# Altium project Fast_Servo.PrjPCB (part 5 of 7)

## Sheet PWR_SMPS.SchDoc: Power SMPS
size 420 x 297 mm; Author: P. Zdunek; DrawnBy: P. Zdunek; Organization: Altium Limited; Address1: L3, 12a Rodborough Rd; Address2: Frenchs Forest; Address3: NSW; Address4: Australia 2086; DocumentNumber: 28; SheetNumber: 28; SheetTotal: 37; ModifiedBy: -; CheckedDate: -; Title2: Fast Stabilizer; DivGrp: WUT ISE; Designer: G.Kasprowicz
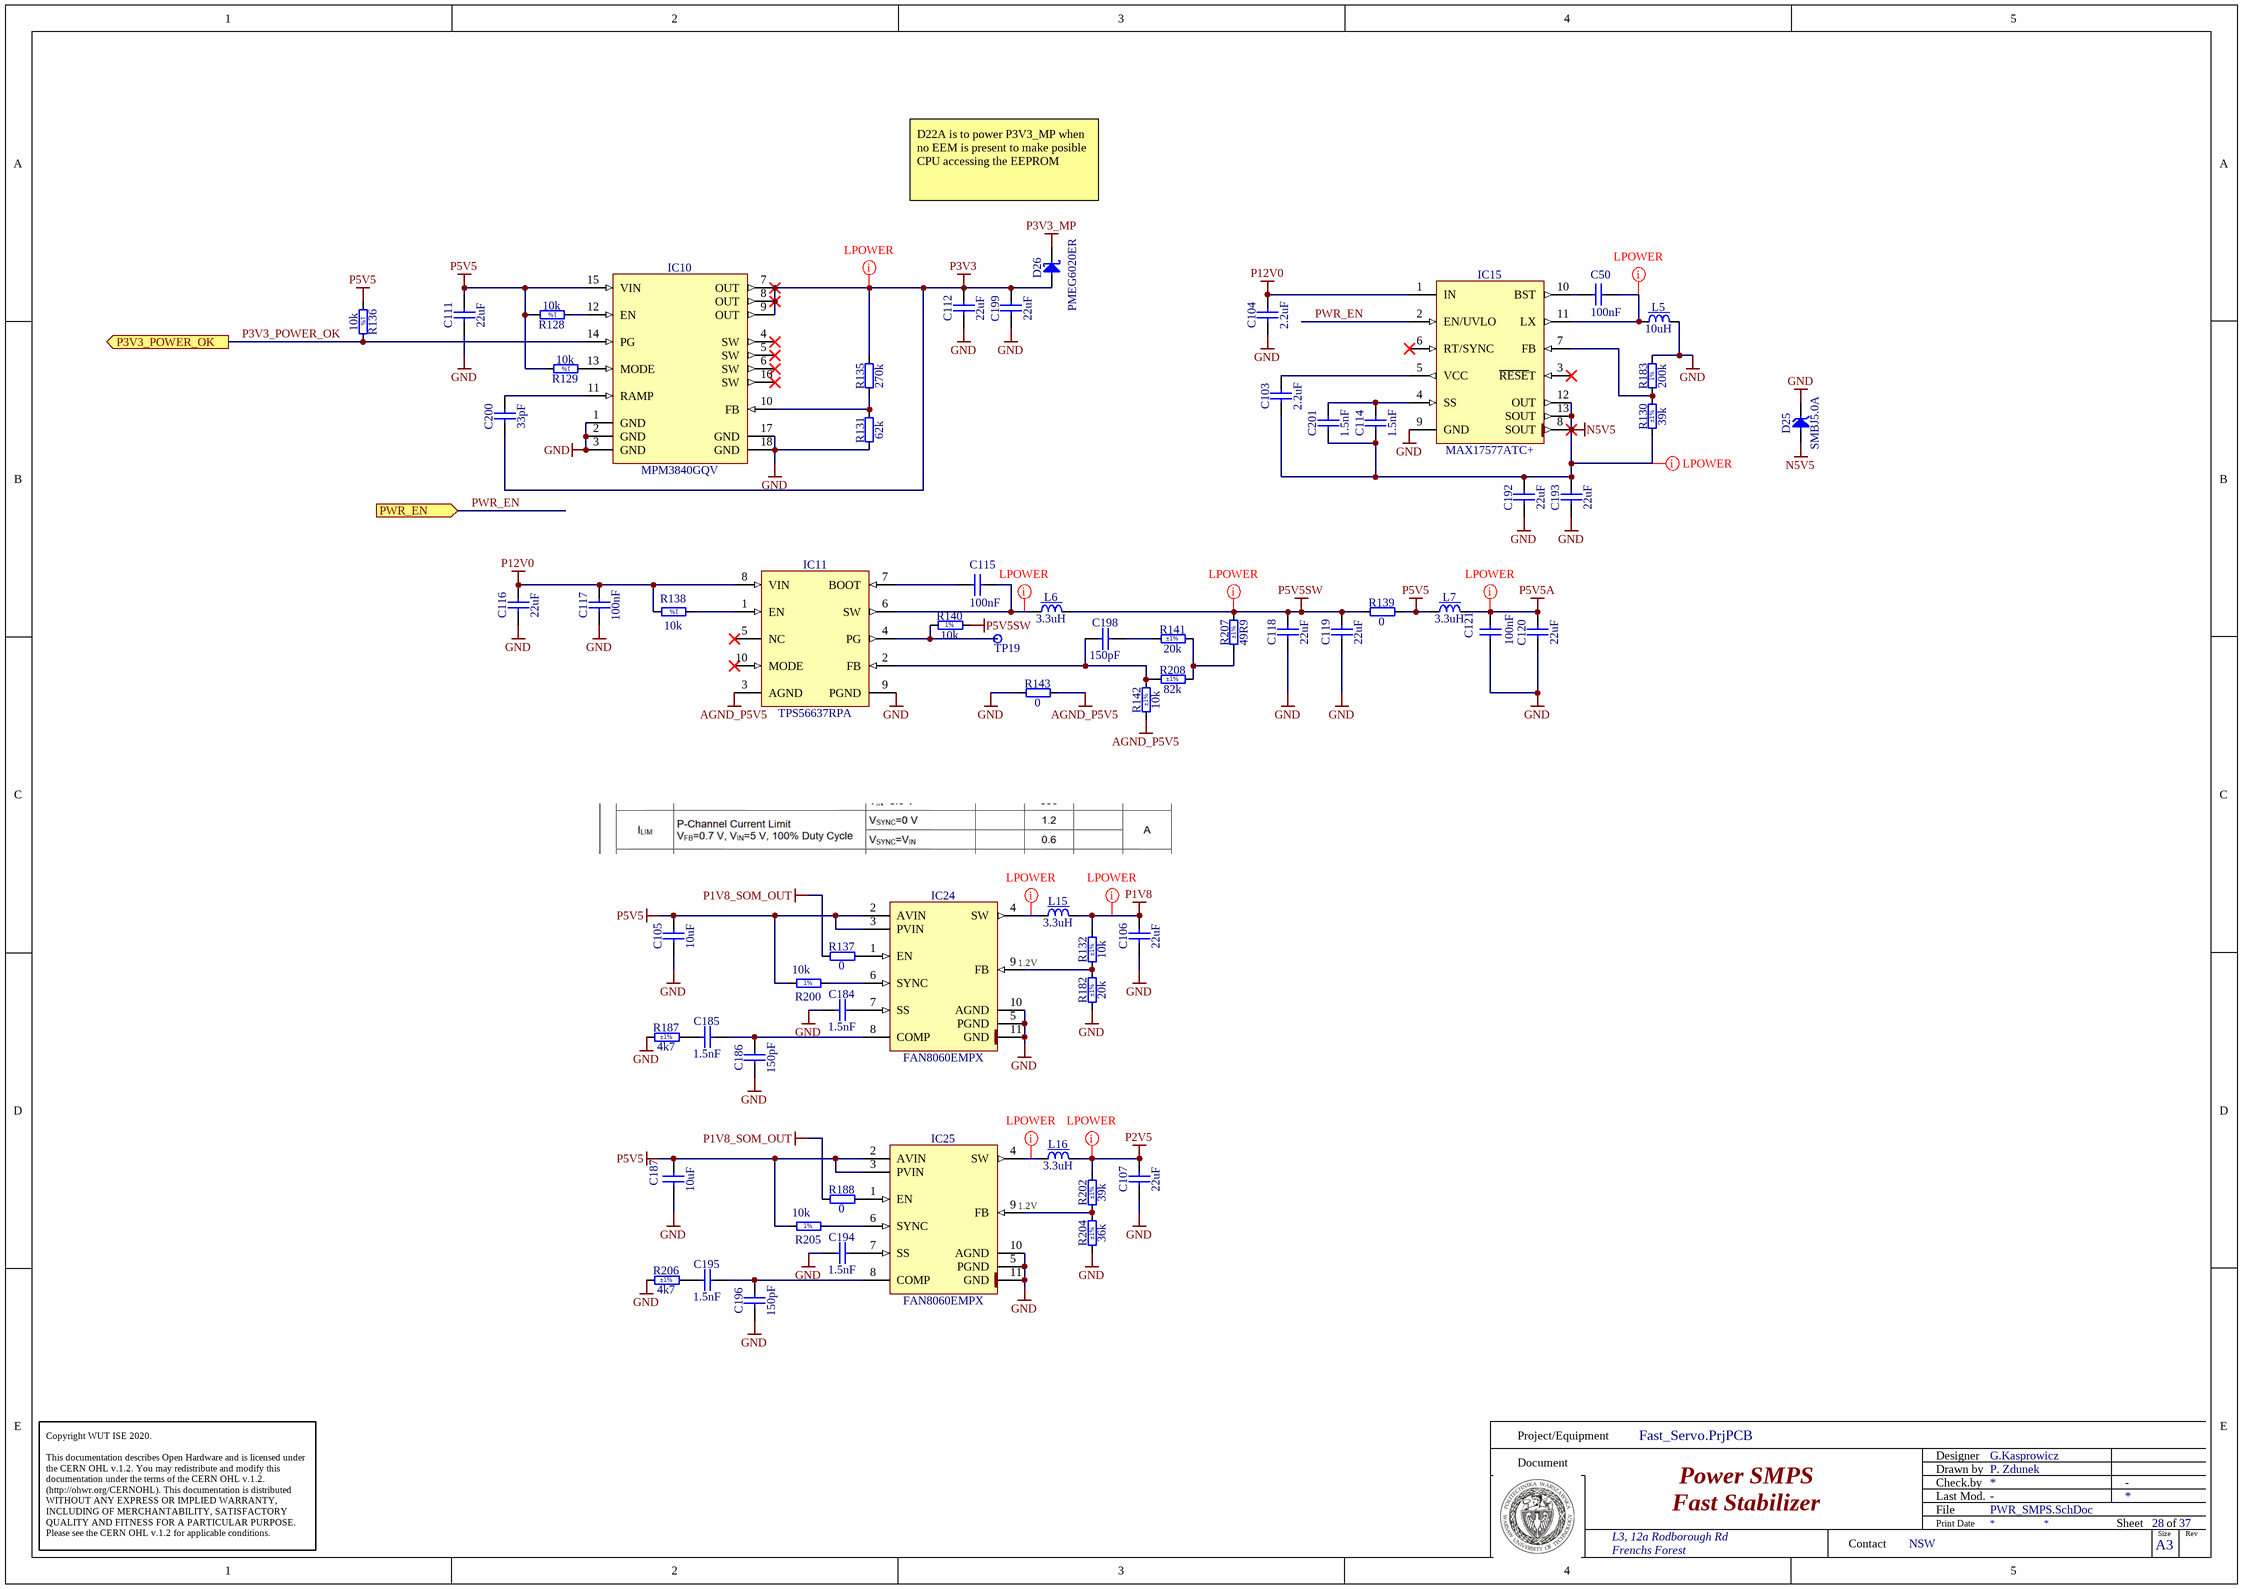
[diagram p20: PWR_SMPS.SchDoc]

### Parts
C50  100nF  [CAPC1005X55N]
C103  2.2uF  [CAPC2012X140N]
C104  2.2uF  [CAPC2012X140N]
C105  10uF  [CAPC1608X80N]
C106  22uF  [CAPC2012X135N]
C107  22uF  [CAPC2012X135N]
C111  22uF  [CAPC2012X135N]
C112  22uF  [CAPC2012X135N]
C114  1.5nF  [CAPC1005X55N]
C115  100nF  [CAPC1005X55N]
C116  22uF  [CAPC2012X135N]
C117  100nF  [CAPC1005X55N]
C118  22uF  [CAPC2012X135N]
C119  22uF  [CAPC2012X135N]
C120  22uF  [CAPC2012X135N]
C121  100nF  [CAPC1005X55N]
C184  1.5nF  [CAPC1005X55N]
C185  1.5nF  [CAPC1005X55N]
C186  150pF  [CAPC1005X55N]
C187  10uF  [CAPC1608X80N]
C192  22uF  [CAPC2012X135N]
C193  22uF  [CAPC2012X135N]
C194  1.5nF  [CAPC1005X55N]
C195  1.5nF  [CAPC1005X55N]
C196  150pF  [CAPC1005X55N]
C198  150pF  [CAPC1005X55N]
C199  22uF  [CAPC2012X135N]
C200  33pF  [CAPC1608X87N]
C201  1.5nF  [CAPC1005X55N]
D25  SMBJ5.0A  [DIOM5336X265N]
D26  PMEG6020ER  [SODFL3517X110N]
IC10  MPM3840GQV  [MPS_MPM38XXGQV]
IC11  TPS56637RPA  [TEXAS_RPA0010A]
IC15  MAX17577ATC+  [SON50P300X300X80-13N-R180X260]
IC24  FAN8060EMPX  [SON50P300X80_HS-11N]
IC25  FAN8060EMPX  [SON50P300X80_HS-11N]
L5  10uH  [IND_TDK_VLCF5020-1]
L6  3.3uH  [INDM6965X300N]
L7  3.3uH  [IND_WURTH_WE-TPC_4828]
L15  3.3uH  [IND_WURTH_WE-TPC_4828]
L16  3.3uH  [IND_WURTH_WE-TPC_4828]
R128  10k  [RESC1005X40N]
R129  10k  [RESC1005X40N]
R130  39k  Tolerance: ±1%  [RESC1005X40N]
R131  62k  [RESC1005X40N]
R132  10k  Tolerance: ±1%  [RESC1005X40N]
R135  270k  [RESC1005X40N]
R136  10k  [RESC1005X40N]
R137  0  [RESC1005X40N]
R138  10k  [RESC1005X40N]
R139  0  [RESC3116X80N]
R140  10k  [RESC1005X40N]
R141  20k  Tolerance: ±1%  [RESC1005X40N]
R142  10k  Tolerance: ±1%  [RESC1005X40N]
R143  0  [RESC1005X40N]
R182  20k  Tolerance: ±1%  [RESC1005X40N]
R183  200k  [RESC1005X40N]
R187  4k7  Tolerance: ±1%  [RESC1005X40N]
R188  0  [RESC1005X40N]
R200  10k  [RESC1005X40N]
R202  39k  Tolerance: ±1%  [RESC1005X40N]
R204  36k  Tolerance: ±1%  [RESC1005X40N]
R205  10k  [RESC1005X40N]
R206  4k7  Tolerance: ±1%  [RESC1005X40N]
R207  49R9  Tolerance: ±1%  [RESC1005X40N]
R208  82k  Tolerance: ±1%  [RESC1608X55N]
TP19  Test Point  [TPS127]  (value not drawn)  (no BOM)

### Ports
P3V3_POWER_OK (out), PWR_EN (in)

### Nets
AGND_P5V5: IC11.3(AGND) R142.1 R143.2
GND: C104.1 C105.1 C106.1 C107.1 C111.1 C112.1 C116.1 C117.1 C118.1 C119.1 C120.1 C121.1 C184.1 C186.1 C187.1 C192.1 C193.1 C194.1 C196.1 C199.1 D25.1(C) IC10.1(GND) IC10.2(GND) IC10.3(GND) IC10.17(GND) IC10.18(GND) IC11.9(PGND) IC15.9(GND) IC24.5(PGND) IC24.10(AGND) IC24.11(GND) IC25.5(PGND) IC25.10(AGND) IC25.11(GND) L5.2 R131.1 R143.1 R182.1 R183.2 R187.1 R204.1 R206.1
N5V5: C103.1 C114.1 C192.2 C193.2 C201.1 D25.2(A) IC15.8(SOUT) IC15.12(OUT) IC15.13(SOUT) R130.1
P1V8: C106.2 L15.2 R132.2
P1V8_SOM_OUT: R137.1 R188.1
P2V5: C107.2 L16.2 R202.2
P3V3: C112.2 C199.2 C200.1 D26.2(A) IC10.7(OUT) IC10.8(OUT) IC10.9(OUT) R135.2
P3V3_MP: D26.1(C)
P5V5: C105.2 C111.2 C187.2 IC10.15(VIN) IC24.2(AVIN) IC24.3(PVIN) IC25.2(AVIN) IC25.3(PVIN) L7.1 R128.2 R129.2 R136.1 R139.2 R200.1 R205.1
P5V5A: C120.2 C121.2 L7.2
P5V5SW: C118.2 C119.2 L6.2 R139.1 R140.2 R207.2
P12V0: C104.2 C116.2 C117.2 IC11.8(VIN) IC15.1(IN) R138.2
P3V3_POWER_OK: IC10.14(PG) R136.2 ; port P3V3_POWER_OK
PWR_EN: IC15.2(EN/UVLO) ; port PWR_EN
NetC50_1: C50.1 IC15.11(LX) L5.1
NetC50_2: C50.2 IC15.10(BST)
NetC103_2: C103.2 IC15.5(VCC)
NetC114_2: C114.2 C201.2 IC15.4(SS)
NetC115_1: C115.1 IC11.6(SW) L6.1
NetC115_2: C115.2 IC11.7(BOOT)
NetC184_2: C184.2 IC24.7(SS)
NetC185_1: C185.1 R187.2
NetC185_2: C185.2 C186.2 IC24.8(COMP)
NetC194_2: C194.2 IC25.7(SS)
NetC195_1: C195.1 R206.2
NetC195_2: C195.2 C196.2 IC25.8(COMP)
NetC198_1: C198.1 IC11.2(FB) R142.2 R208.1
NetC198_2: C198.2 R141.1
NetC200_2: C200.2 IC10.11(RAMP)
NetIC10_10: IC10.10(FB) R131.2 R135.1
NetIC10_12: IC10.12(EN) R128.1
NetIC10_13: IC10.13(MODE) R129.1
NetIC11_1: IC11.1(EN) R138.1
NetIC11_4: IC11.4(PG) R140.1 TP19.1
NetIC15_7: IC15.7(FB) R130.2 R183.1
NetIC24_1: IC24.1(EN) R137.2
NetIC24_4: IC24.4(SW) L15.1
NetIC24_6: IC24.6(SYNC) R200.2
NetIC24_9: IC24.9(FB) R132.1 R182.2
NetIC25_1: IC25.1(EN) R188.2
NetIC25_4: IC25.4(SW) L16.1
NetIC25_6: IC25.6(SYNC) R205.2
NetIC25_9: IC25.9(FB) R202.1 R204.2
NetR141_2: R141.2 R207.1 R208.2

Not connected (* = marked no-connect by the designer): IC10 4(SW)* 5(SW)* 6(SW)* 16(SW)*; IC11 5(NC)* 10(MODE)*; IC15 3(~{RESE}T)* 6(RT/SYNC)*

### Layout directives
net class Lpower: N5V5, NetC50_1, NetC115_1, NetIC24_4, NetIC25_4, P1V8, P2V5, P3V3, P5V5A, P5V5SW

### Notes on the sheet
- D22A is to power P3V3_MP when no EEM is present to make posible CPU accessing the EEPROM
- (near IC24) 1.2V
- (near IC25) 1.2V
- Project/Equipment
- Document
- Designer
- Drawn by
- Check.by
- Copyright WUT ISE 2020.
  This documentation describes Open Hardware and is licensed under the CERN OHL v.1.2. You may redistribute and modify this documentation under the terms of the CERN OHL v.1.2. (http://ohwr.org/CERNOHL). This documentation is distributed WITHOUT ANY EXPRESS OR IMPLIED WARRANTY, INCLUDING OF MERCHANTABILITY, SATISFACTORY QUALITY AND FITNESS FOR A PARTICULAR PURPOSE. Please see the CERN OHL v.1.2 for applicable conditions.
- Contact
- File
- Last Mod.
- Print Date
- Sheet
- Size
- A3
- of
- Rev
- (in symbol R0402_10K_1%_0.0625W_100PPM) 1%
- (in symbol R0402_200K_1%_0.0625W_100PPM) 1%

### Library data of the parts
C50 C115 C117 C121 = CC0402_100NF_16V_10%_X5R: Non-polarised capacitor; Part Description: SMD Multilayer Chip Ceramic Capacitor; Manufacturer: GENERIC; Manufacturer1 Part Number: GRM155R61C104KA88D; Voltage: 16V; TC: X5R; Tolerance: ±10%; Part Number: CC0402_100NF_16V_10%_X5R; Component Kind: Standard; Component Type: Standard; Pin Count: 2; Value: 100nF; Status: None; Manufacturer Part Number: CC0402_100NF_16V_10%_X5R; Case: 0402; Mounted: Yes; Socket: No; SMD: Yes; Sense: No; Manufacturer1 Example: MURATA; Manufacturer1 ComponentHeight: 0.55mm; HelpURL: \\cern.ch\dfs\Applications\Altium\Datasheets\CC0402_X5R_MURATA_GRM.pdf; Author: CERN DEM JLC; CreateDate: 10.12.2013; LatestRevisionDate: 10.12.2013
C103 C104 = CC0805_2.2UF_50V_10%_X7R: Non-polarised capacitor; Part Description: SMD Multilayer Chip Ceramic Capacitor; Manufacturer: GENERIC; Manufacturer1 Part Number: GRM21BR61H225KA73L; Voltage: 50V; TC: X7R; Tolerance: ±10%; Part Number: CC0805_2.2UF_50V_10%_X7R; Component Kind: Standard; Component Type: Standard; Pin Count: 2; Value: 2.2uF; Status: Preferred; Manufacturer Part Number: CC0805_2.2UF_50V_10%_X7R; Case: 0805; Mounted: Yes; Socket: No; SMD: Yes; Sense: No; Manufacturer1 Example: MURATA; Manufacturer1 ComponentHeight: 1.40mm; HelpURL: \\cern.ch\dfs\Applications\Altium\Datasheets\CC0805_X7R_MURATA_GRM.pdf; Author: CERN DEM JLC; CreateDate: 18/08/2014; LatestRevisionDate: 18/08/2014
C105 C187 = CC0603_10UF_10V_10%_X5R: Non-polarised capacitor; Part Description: SMD Multilayer Chip Ceramic Capacitor; Manufacturer: GENERIC; Manufacturer1 Part Number: GRM188R61A106KE69D; Voltage: 10V; TC: X5R; Tolerance: ±10%; Part Number: CC0603_10UF_10V_10%_X5R; Component Kind: Standard; Component Type: Standard; Pin Count: 2; Value: 10uF; Status: None; Manufacturer Part Number: CC0603_10UF_10V_10%_X5R; Case: 0603; Mounted: Yes; Socket: No; SMD: Yes; Sense: No; Manufacturer1 Example: MURATA; Manufacturer1 ComponentHeight: 0.8mm; HelpURL: \\cern.ch\dfs\Applications\Altium\Datasheets\CC0603_MURATA_GRM188R61A106KE69D.pdf; Author: CERN DEM JLC; CreateDate: 31/01/2017; LatestRevisionDate: 31/01/2017
C106 C107 C111 C112 C116 C118-C120 C192 C193 C199 = CC0805_22UF_16V_10%_X5R: Non-polarised capacitor; Part Description: SMD Multilayer Chip Ceramic Capacitor; Manufacturer: GENERIC; Manufacturer1 Part Number: C2012X5R1C226KT; Voltage: 16V; TC: X5R; Tolerance: ±10%; Part Number: CC0805_22UF_16V_10%_X5R; Component Kind: Standard; Component Type: Standard; Pin Count: 2; Value: 22uF; Status: Preferred; Manufacturer Part Number: CC0805_22UF_16V_10%_X5R; Case: 0805; Mounted: Yes; Socket: No; SMD: Yes; Sense: No; Manufacturer1 Example: TDK; Manufacturer1 ComponentHeight: 1.35mm; HelpURL: \\cern.ch\dfs\Applications\Altium\Datasheets\CC0805_X5R_TDK_C.pdf; Author: CERN DEM JLC
  C106 C107 C111 C112 C116 C120 C192 C193 C199: CreateDate: 25.10.2012; LatestRevisionDate: 25.10.2012
  C118 C119: CreateDate: 25-Oct-12; LatestRevisionDate: 25-Oct-12
C114 C184 C185 C194 C195 C201 = CC0402_1.5NF_50V_5%_C0G: Non-polarised capacitor; Part Description: SMD Multilayer Chip Ceramic Capacitor; Manufacturer: GENERIC; Manufacturer1 Part Number: C0402C152J5GACTU; Voltage: 50V; TC: C0G/NP0; Tolerance: ±5%; Part Number: CC0402_1.5NF_50V_5%_C0G; Component Kind: Standard; Component Type: Standard; Pin Count: 2; Value: 1.5nF; Status: Preferred; Manufacturer Part Number: CC0402_1.5NF_50V_5%_C0G; Case: 0402; Mounted: Yes; Socket: No; SMD: Yes; Sense: No; Manufacturer1 Example: KEMET; Manufacturer1 ComponentHeight: 0.55mm; HelpURL: \\cern.ch\dfs\Applications\Altium\Datasheets\CC0402_C0G_KEMET_(Commercial Grade).pdf; Author: CERN DEM BC; CreateDate: 02.09.2019; LatestRevisionDate: 02.09.2019
C186 C196 C198 = CC0402_150PF_50V_5%_C0G: Non-polarised capacitor; Part Description: SMD Multilayer Chip Ceramic Capacitor; Manufacturer: GENERIC; Manufacturer1 Part Number: C0402C151J5GACTU; Voltage: 50V; TC: C0G/NP0; Tolerance: ±5%; Part Number: CC0402_150PF_50V_5%_C0G; Component Kind: Standard; Component Type: Standard; Pin Count: 2; Value: 150pF; Status: Preferred; Manufacturer Part Number: CC0402_150PF_50V_5%_C0G; Case: 0402; Mounted: Yes; Socket: No; SMD: Yes; Sense: No; Manufacturer1 Example: KEMET; Manufacturer1 ComponentHeight: 0.55mm; HelpURL: \\cern.ch\dfs\Applications\Altium\Datasheets\CC0402_C0G_KEMET_(Commercial Grade).pdf; Author: CERN DEM JLC; CreateDate: 03.12.2007; LatestRevisionDate: 22.04.2015
C200 = CC0603_33PF_50V_5%_NP0: Non-polarised capacitor; Part Description: SMD Multilayer Chip Ceramic Capacitor; Manufacturer: GENERIC; Manufacturer1 Part Number: 223886715339; Voltage: 50V; TC: C0G/NP0; Tolerance: ±5%; Part Number: CC0603_33PF_50V_5%_NP0; Component Kind: Standard; Component Type: Standard; Pin Count: 2; Value: 33pF; Status: Preferred; Manufacturer Part Number: CC0603_33PF_50V_5%_NP0; Case: 0603; Mounted: Yes; Socket: No; SMD: Yes; Sense: No; Manufacturer1 Example: PHYCOMP; Manufacturer1 ComponentHeight: 0.87mm; HelpURL: \\cern.ch\dfs\Applications\Altium\Datasheets\CC0603_NP0_PHYCOMP.pdf; Author: CERN DEM JLC; CreateDate: 03.12.2007; LatestRevisionDate: 03.12.2007
D25 = SMBJ5V0A: Zener Diode; Part Description: Uni-Directional Transient Voltage Suppressor Diode; Manufacturer: DIODES; Voltage: 5V; Power: 600W; PressFit: No; Bonding: No; Part Number: SMBJ5.0A; Component Kind: Standard; Component Type: Standard; Device: SMBJ5.0A; PackageDescription: DO-214-AA/SMB Diode, Molded Body; 5.34mm L X 3.625mm W X 2.65mm H, IPC Medium Density; Manufacturer Part Number: SMBJ5.0A; Pin Count: 2; Case: DO-214AA; Mounted: Yes; Socket: No; SMD: Yes; Sense: No; ComponentHeight: 2.65mm; HelpURL: \\cern.ch\dfs\Applications\Altium\Datasheets\SMBJ.pdf; Author: GK; CreateDate: 08-Dec-08; LatestRevisionDate: 19-Dec-11
D26 = PMEG6020ER: Schottky Diode; Part Description: MEGA Schottky Barrier Rectifier; Manufacturer: NXP SEMICONDUCTORS; Voltage: 60V; Power: 2A; PressFit: No; Bonding: No; Part Number: PMEG6020ER; Component Kind: Standard; Component Type: Standard; Device: PMEG6020ER; PackageDescription: SODFL Diode (SOD123W); 2.60mm W X 1.70mm L X 1.10mm H body, IPC Medium Density; Manufacturer Part Number: PMEG6020ER; Pin Count: 2; Case: SOD-123FL; Mounted: Yes; Socket: No; SMD: Yes; Sense: No; ComponentHeight: 1.1mm; HelpURL: \\cern.ch\dfs\Applications\Altium\Datasheets\PMEG6020ER.pdf; Author: CERN DEM JMW; CreateDate: 19.06.2014; LatestRevisionDate: 19.06.2014
IC10 = MPM3840GQV: 2.8V to 5.5V Input, 4A, Power Module Synchronous Step-Down Converter with Integrated Inductor; Manufacturer: MPS (MONOLITIC  POWER SYSTEMS); PressFit: No; Bonding: No; Part Number: MPM3840GQV; Component Kind: Standard; Component Type: Standard; Device: MPM3840GQV; PackageDescription: MPS QFN-20 Case, 0.50mm Pitch, Rect.; 18 Pin, 3.00mm L X 5.00mm W X 1.65mm H body, (w/Thermal Tab x2); Part Description: 2.8V to 5.5V Input, 4A, Power Module Synchronous Step-Down Converter with Integrated Inductor; Manufacturer Part Number: MPM3840GQV; Pin Count: 20; Case: QFN20; Mounted: Yes; Socket: No; SMD: Yes; Sense: No; ComponentHeight: 1.65mm; HelpURL: \\cern.ch\dfs\Applications\Altium\Datasheets\MPM3840GQV.pdf; Author: CERN DEM BC; CreateDate: 23.11.2020; LatestRevisionDate: 23.11.2020
IC11 = TPS56637RPA: 4.5V to 28V Input, 6A Synchronous Buck Converter; Manufacturer: TEXAS INSTRUMENTS; PressFit: No; Bonding: No; Part Number: TPS56637RPA; Component Kind: Standard; Component Type: Standard; Device: TPS56637RPA; PackageDescription: TEXAS Case Style RPA0010A, QFN, 0.50mm Pitch; 10 Pin, 3.00mm W X3.00mm L X 1.00mm H body; Part Description: 4.5V to 28V Input, 6A Synchronous Buck Converter; Manufacturer Part Number: TPS56637RPA; Pin Count: 10; Mounted: Yes; Socket: No; SMD: Yes; Sense: No; ComponentHeight: 1mm; HelpURL: \\cern.ch\dfs\Applications\Altium\Datasheets\TPS56637RPA.pdf; Author: CERN DEM BC; CreateDate: 06/07/2020; LatestRevisionDate: 06/07/2020
IC15 = MAX17577ATC+: 4.5V to 60V, 1A High-Efficiency, Synchronous, Inverting Output DC-DC Converters; Manufacturer: MAXIM; PressFit: No; Bonding: No; Part Number: MAX17577ATC+; Component Kind: Standard; Component Type: Standard; Device: MAX17577ATC+; PackageDescription: SON, 0.50mm Pitch, 12-Pin, 3.00mm W  X 3.00mm L X 0.80mm H body, (w/Thermal Tab 1.80 X 2.60mm), IPC Medium Density; Part Description: 4.5V to 60V, 1A High-Efficiency, Synchronous, Inverting Output DC-DC Converters; Manufacturer Part Number: MAX17577ATC+; Pin Count: 13; Case: SON12; Mounted: Yes; Socket: No; SMD: Yes; Sense: No; ComponentHeight: 0.8mm; HelpURL: \\cern.ch\dfs\Applications\Altium\Datasheets\MAX17577ATC+.pdf; Author: CERN DEM HF; CreateDate: 22.10.2021; LatestRevisionDate: 22.10.2021
IC24 IC25 = PM_FAN8060: 2.5 to 5.5 V 1 A 1.2 MHz Step-Down DC/DC; Manufacturer: ON SEMICONDUCTOR; PressFit: No; Bonding: No; Part Number: FAN8060EMPX; Component Kind: Standard; Component Type: Standard; Device: FAN8060EMPX; PackageDescription: SON, 10-Leads, Body 3,00x3,00mm, Pitch 0,50mm, Thermal Pad 2,25x1,55mm, IPC Medium Density; Part Description: 2.5 to 5.5 V 1 A 1.2 MHz Step-Down DC/DC; Manufacturer Part Number: FAN8060EMPX; Pin Count: 13; Case: SON10; Mounted: Yes; Socket: No; SMD: Yes; Sense: No; ComponentHeight: 0.8mm; HelpURL: \\cern.ch\dfs\Applications\Altium\Datasheets\FAN5354MPX.pdf; Author: GK; CreateDate: 22.10.2021; LatestRevisionDate: 22.10.2021
L5 = IND_10UH_20%_TDK_VLCF5020-1: Inductor With Core; Part Description: SMD Inductor for Power Circuits (Wound/STD , Magnetic Shielded), VLCF series; Manufacturer: TDK; Manufacturer Part Number: VLCF5020T-100M1R1-1; Power: 1.5A; Resistance: 0.198R; Tolerance: ±20%; Part Number: IND_10UH_20%_TDK_VLCF5020-1; Component Kind: Standard; Component Type: Standard; Pin Count: 2; Value: 10uH; Mounted: Yes; Socket: No; SMD: Yes; Sense: No; ComponentHeight: 2mm; HelpURL: \\cern.ch\dfs\Applications\Altium\Datasheets\IND_TDK_VLCF.pdf; Author: CERN DEM JLC; CreateDate: 10.07.2014; LatestRevisionDate: 10.07.2014
L6 = IND2525_3.3UH_20%_VISHAY_IHLP-2525CZ-01: Inductor With Core; Part Description: Low Profile, High Current IHLP® Inductor; Manufacturer: VISHAY DALE; Manufacturer Part Number: IHLP2525CZER3R3M01; Power: 6A; Resistance: 0.028R; Tolerance: ±20%; Part Number: IND2525_3.3UH_20%_VISHAY_IHLP-2525CZ-01; Component Kind: Standard; Component Type: Standard; Pin Count: 2; Value: 3.3uH; Case: 2525; Mounted: Yes; Socket: No; SMD: Yes; Sense: No; ComponentHeight: 3mm; HelpURL: \\cern.ch\dfs\Applications\Altium\Datasheets\IND2525_VISHAY_IHLP-2525CZ-01.pdf; Author: CERN DEM MR; CreateDate: 29.06.2017; LatestRevisionDate: 29.06.2017
L7 L15 L16 = IND_3.3UH_30%_WURTH_WE-TPC_744043003: Inductor With Core; Part Description: Shielded Tiny Power Inductor (WE-TPC Serie); Manufacturer: WURTH ELEKTRONIK; Power: 2.15A; Resistance: 0.03R; Tolerance: ±30%; Part Number: IND_3.3UH_30%_WURTH_WE-TPC_744043003; Component Kind: Standard; Component Type: Standard; Pin Count: 2; Value: 3.3uH; Manufacturer Part Number: 744043003; Mounted: Yes; Socket: No; SMD: Yes; Sense: No; ComponentHeight: 3mm; HelpURL: \\cern.ch\dfs\Applications\Altium\Datasheets\IND_WURTH_WE-TPC_744043003.pdf; Author: CERN DEM JLC; CreateDate: 12.07.2011; LatestRevisionDate: 24.01.2012
R128 R129 R136 R138 R140 R200 R205 = R0402_10K_1%_0.0625W_100PPM: Resistor - 1%; Part Description: General Purpose Thick Film Chip Resistor; Manufacturer: GENERIC; Manufacturer1 Part Number: 232270671003L; PressFit: No; TC: ±100ppm/°C; Part Number: R0402_10K_1%_0.0625W_100PPM; Component Kind: Standard; Component Type: Standard; Pin Count: 2; Value: 10k; Status: Not Recommended; Manufacturer Part Number: R0402_10K_1%_0.0625W_100PPM; Case: 0402; Mounted: Yes; Sense: No; Socket: No; SMD: Yes; Manufacturer1 Example: YAGEO PHYCOMP; Manufacturer1 ComponentHeight: 0.4mm; HelpURL: \\cern.ch\dfs\Applications\Altium\Datasheets\R0402_Phycomp_RC0402.pdf; Author: CERN DEM JLC; Power: 0.0625W; Tolerance: ±1%
  R128 R129 R136: CreateDate: 03/12/2007; LatestRevisionDate: 17/10/2012
  R138 R140 R200 R205: CreateDate: 03-Dec-07; LatestRevisionDate: 17-Oct-12
R130 R202 = R0402_39K_1%_0.0625W_100PPM: Resistor - 1%; Part Description: General Purpose Thick Film Chip Resistor; Manufacturer: GENERIC; Manufacturer1 Part Number: 232270673903; TC: ±100ppm/°C; PressFit: No; Part Number: R0402_39K_1%_0.0625W_100PPM; Component Kind: Standard; Component Type: Standard; Pin Count: 2; Value: 39k; Status: Not Recommended; Power: 0.0625W; Manufacturer Part Number: R0402_39K_1%_0.0625W_100PPM; Case: 0402; Mounted: Yes; Sense: No; Socket: No; SMD: Yes; Manufacturer1 Example: YAGEO PHYCOMP; Manufacturer1 ComponentHeight: 0.4mm; HelpURL: \\cern.ch\dfs\Applications\Altium\Datasheets\R0402_Phycomp_RC0402.pdf; Author: CERN DEM JLC; CreateDate: 03.12.2007; LatestRevisionDate: 17.10.2012
R131 = R0402_62K_1%_0.0625W_100PPM: Resistor - 1%; Part Description: General Purpose Thick Film Chip Resistor; Manufacturer: GENERIC; Manufacturer1 Part Number: 232270676203L; PressFit: No; TC: ±100ppm/°C; Part Number: R0402_62K_1%_0.0625W_100PPM; Component Kind: Standard; Component Type: Standard; Pin Count: 2; Value: 62k; Status: Not Recommended; Manufacturer Part Number: R0402_62K_1%_0.0625W_100PPM; Case: 0402; Mounted: Yes; Sense: No; Socket: No; SMD: Yes; Manufacturer1 Example: YAGEO PHYCOMP; Manufacturer1 ComponentHeight: 0.4mm; HelpURL: \\cern.ch\dfs\Applications\Altium\Datasheets\R0402_Phycomp_RC0402.pdf; Author: CERN DEM JLC; CreateDate: 03.12.2007; LatestRevisionDate: 17.10.2012; Power: 0.0625W; Tolerance: ±1%
R132 R142 = R0402_10K_1%_0.0625W_100PPM: Resistor - 1%; Part Description: General Purpose Thick Film Chip Resistor; Manufacturer: GENERIC; Manufacturer1 Part Number: 232270671003L; TC: ±100ppm/°C; PressFit: No; Part Number: R0402_10K_1%_0.0625W_100PPM; Component Kind: Standard; Component Type: Standard; Pin Count: 2; Value: 10k; Status: Not Recommended; Power: 0.0625W; Manufacturer Part Number: R0402_10K_1%_0.0625W_100PPM; Case: 0402; Mounted: Yes; Sense: No; Socket: No; SMD: Yes; Manufacturer1 Example: YAGEO PHYCOMP; Manufacturer1 ComponentHeight: 0.4mm; HelpURL: \\cern.ch\dfs\Applications\Altium\Datasheets\R0402_Phycomp_RC0402.pdf; Author: CERN DEM JLC; CreateDate: 03.12.2007; LatestRevisionDate: 17.10.2012
R135 = R0402_270K_1%_0.0625W_100PPM: Resistor - 1%; Part Description: General Purpose Thick Film Chip Resistor; Manufacturer: GENERIC; Manufacturer1 Part Number: 232270672704L; PressFit: No; TC: ±100ppm/°C; Part Number: R0402_270K_1%_0.0625W_100PPM; Component Kind: Standard; Component Type: Standard; Pin Count: 2; Value: 270k; Status: Not Recommended; Manufacturer Part Number: R0402_270K_1%_0.0625W_100PPM; Case: 0402; Mounted: Yes; Sense: No; Socket: No; SMD: Yes; Manufacturer1 Example: YAGEO PHYCOMP; Manufacturer1 ComponentHeight: 0.4mm; HelpURL: \\cern.ch\dfs\Applications\Altium\Datasheets\R0402_Phycomp_RC0402.pdf; Author: CERN DEM JLC; CreateDate: 03.12.2007; LatestRevisionDate: 17.10.2012; Power: 0.0625W; Tolerance: ±1%
R137 R143 R188 = R0402_0R_JUMPER: Resistor; Part Description: 1A (0.05R Max DC Resistance) Zero Ohm Jumper; Manufacturer: GENERIC; Manufacturer1 Part Number: 232270591001L; PressFit: No; Part Number: R0402_0R_JUMPER; Component Kind: Standard; Component Type: Standard; Pin Count: 2; Value: 0; Status: Not Recommended; Manufacturer Part Number: R0402_0R_JUMPER; Case: 0402; Mounted: Yes; Sense: No; Socket: No; SMD: Yes; Manufacturer1 Example: YAGEO PHYCOMP; Manufacturer1 ComponentHeight: 0.4mm; HelpURL: \\cern.ch\dfs\Applications\Altium\Datasheets\R0402_Phycomp_RC0402.pdf; Author: CERN DEM JLC; CreateDate: 03/12/2007; LatestRevisionDate: 17/10/2012
R139 = R1206_0R_JUMPER_SEI_HCJ: Resistor; Part Description: 38.7A (0.0005R Max DC Resistance) Zero Ohm Jumper; Manufacturer: SEI (STACKPOLE ELECTRONICS INC.); Manufacturer Part Number: HCJ1206ZT0R00; PressFit: No; Part Number: R1206_0R_JUMPER_SEI_HCJ; Component Kind: Standard; Component Type: Standard; Pin Count: 2; Value: 0; Status: Not Recommended; Case: 1206; Mounted: Yes; Sense: No; Socket: No; SMD: Yes; HelpURL: \\cern.ch\dfs\Applications\Altium\Datasheets\R1206_SEI_HCJ.pdf; Author: CERN DEM MR; CreateDate: 20/02/2018; LatestRevisionDate: 20/02/2018; ComponentHeight: 0.8mm
R141 R182 = R0402_20K_1%_0.0625W_100PPM: Resistor - 1%; Part Description: General Purpose Thick Film Chip Resistor; Manufacturer: GENERIC; Manufacturer1 Part Number: 232270672003L; TC: ±100ppm/°C; PressFit: No; Part Number: R0402_20K_1%_0.0625W_100PPM; Component Kind: Standard; Component Type: Standard; Pin Count: 2; Value: 20k; Status: Not Recommended; Power: 0.0625W; Manufacturer Part Number: R0402_20K_1%_0.0625W_100PPM; Case: 0402; Mounted: Yes; Sense: No; Socket: No; SMD: Yes; Manufacturer1 Example: YAGEO PHYCOMP; Manufacturer1 ComponentHeight: 0.4mm; HelpURL: \\cern.ch\dfs\Applications\Altium\Datasheets\R0402_Phycomp_RC0402.pdf; Author: CERN DEM JLC; CreateDate: 03.12.2007; LatestRevisionDate: 17.10.2012
R183 = R0402_200K_1%_0.0625W_100PPM: Resistor - 1%; Part Description: General Purpose Thick Film Chip Resistor; Manufacturer: GENERIC; Manufacturer1 Part Number: 232270672004L; TC: ±100ppm/°C; PressFit: No; Part Number: R0402_200K_1%_0.0625W_100PPM; Component Kind: Standard; Component Type: Standard; Pin Count: 2; Value: 200k; Status: Not Recommended; Power: 0.0625W; Tolerance: ±1%; Manufacturer Part Number: R0402_200K_1%_0.0625W_100PPM; Case: 0402; Mounted: Yes; Sense: No; Socket: No; SMD: Yes; Manufacturer1 Example: YAGEO PHYCOMP; Manufacturer1 ComponentHeight: 0.4mm; HelpURL: \\cern.ch\dfs\Applications\Altium\Datasheets\R0402_Phycomp_RC0402.pdf; Author: CERN DEM JLC; CreateDate: 03/12/2007; LatestRevisionDate: 17/10/2012
R187 R206 = R0402_4K7_1%_0.0625W_100PPM: Resistor - 1%; Part Description: General Purpose Thick Film Chip Resistor; Manufacturer: GENERIC; Manufacturer1 Part Number: 232270674702L; TC: ±100ppm/°C; PressFit: No; Part Number: R0402_4K7_1%_0.0625W_100PPM; Component Kind: Standard; Component Type: Standard; Pin Count: 2; Value: 4k7; Status: Not Recommended; Power: 0.0625W; Manufacturer Part Number: R0402_4K7_1%_0.0625W_100PPM; Case: 0402; Mounted: Yes; Sense: No; Socket: No; SMD: Yes; Manufacturer1 Example: YAGEO PHYCOMP; Manufacturer1 ComponentHeight: 0.4mm; HelpURL: \\cern.ch\dfs\Applications\Altium\Datasheets\R0402_Phycomp_RC0402.pdf; Author: CERN DEM JLC; CreateDate: 03.12.2007; LatestRevisionDate: 17.10.2012
R204 = R0402_36K_1%_0.0625W_100PPM: Resistor - 1%; Part Description: General Purpose Thick Film Chip Resistor; Manufacturer: GENERIC; Manufacturer1 Part Number: 232270673603L; TC: ±100ppm/°C; PressFit: No; Part Number: R0402_36K_1%_0.0625W_100PPM; Component Kind: Standard; Component Type: Standard; Pin Count: 2; Value: 36k; Status: Not Recommended; Power: 0.0625W; Manufacturer Part Number: R0402_36K_1%_0.0625W_100PPM; Case: 0402; Mounted: Yes; Sense: No; Socket: No; SMD: Yes; Manufacturer1 Example: YAGEO PHYCOMP; Manufacturer1 ComponentHeight: 0.4mm; HelpURL: \\cern.ch\dfs\Applications\Altium\Datasheets\R0402_Phycomp_RC0402.pdf; Author: CERN DEM JLC; CreateDate: 03.12.2007; LatestRevisionDate: 17.10.2012
R207 = R0402_49R9_1%_0.0625W_100PPM: Resistor - 1%; Part Description: General Purpose Thick Film Chip Resistor; Manufacturer: GENERIC; Manufacturer1 Part Number: 232270674999L or RC0402FR-0749R9L; TC: ±100ppm/°C; PressFit: No; Part Number: R0402_49R9_1%_0.0625W_100PPM; Component Kind: Standard; Component Type: Standard; Pin Count: 2; Value: 49R9; Status: Not Recommended; Power: 0.0625W; Manufacturer Part Number: R0402_49R9_1%_0.0625W_100PPM; Case: 0402; Mounted: Yes; Sense: No; Socket: No; SMD: Yes; Manufacturer1 Example: YAGEO PHYCOMP; Manufacturer1 ComponentHeight: 0.4mm; HelpURL: \\cern.ch\dfs\Applications\Altium\Datasheets\R0402_Phycomp_RC0402.pdf; Author: CERN DEM JLC; CreateDate: 24.10.2012; LatestRevisionDate: 24.10.2012
R208 = R0603_82K_1%_0.1W_100PPM: Resistor - 1%; Part Description: General Purpose Thick Film Chip Resistor; Manufacturer: GENERIC; Manufacturer1 Part Number: NRC06F8202TRF; Power: 0.1W; TC: ±100ppm/°C; PressFit: No; Part Number: R0603_82K_1%_0.1W_100PPM; Component Kind: Standard; Component Type: Standard; Pin Count: 2; Value: 82k; Status: Preferred; Manufacturer Part Number: R0603_82K_1%_0.1W_100PPM; Case: 0603; Mounted: Yes; Sense: No; Socket: No; SMD: Yes; Manufacturer1 Example: NIC COMPONENT; Manufacturer1 ComponentHeight: 0.55mm; HelpURL: \\cern.ch\dfs\Applications\Altium\Datasheets\R0603_NIC_NRC.pdf; Author: CERN DEM JLC; CreateDate: 03.12.2007; LatestRevisionDate: 13.03.2008
TP19 = SMD_PAD_1.27X1.27MM: as TP1-TP13 on sheet POWER_SUPPLY; Part Number: SMD_PAD_1.27X1.27MM; Component Type: Standard (No BOM); Pin Count: 1; Family: Test Point; Socket: No; SMD: Yes; Sense: No; Status: None; ComponentHeight: 0mm; HelpURL: Undefined; Author: CERN DEM JLC; CreateDate: 12.01.2008; LatestRevisionDate: 12.01.2008; PackageDescription: 1.27mm x 1.27mm PCB Copper Area (SMD Test Point)